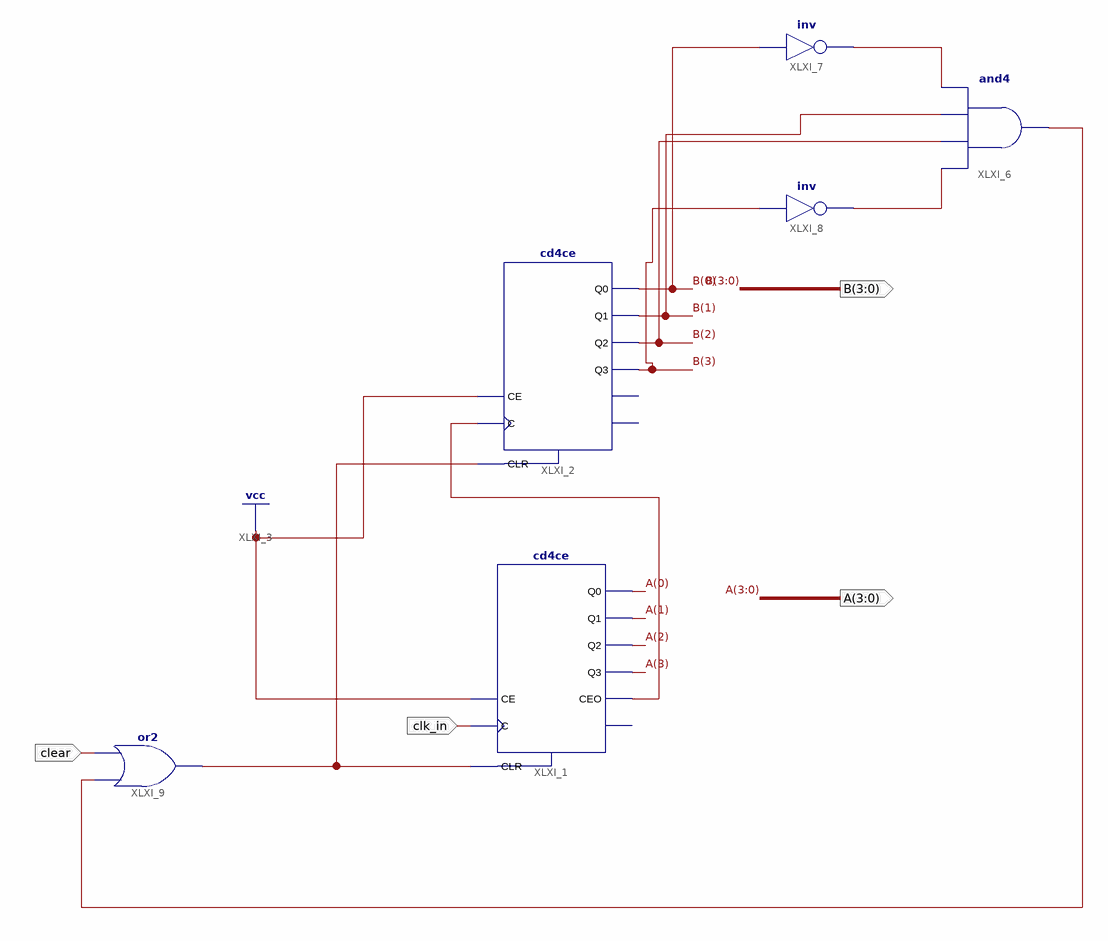
[diagram p0: schematic sheet 1]
// Xilinx ISE schematic counter_sec.sch (spartan6) as structural Verilog: 6 symbols, 4 ports
module counter_sec (
  input  clk_in,
  input  clear,
  output [3:0] A,
  output [3:0] B
);

  wire XLXN_14, XLXN_22, XLXN_26, XLXN_29, XLXN_31;

  cd4ce XLXI_1 (
    .C(clk_in), .CE(1'b1), .CLR(XLXN_31), .CEO(XLXN_14), .Q0(A[0]), .Q1(A[1]), .Q2(A[2]), .Q3(A[3]));  // open: TC
  cd4ce XLXI_2 (.C(XLXN_14), .CE(1'b1), .CLR(XLXN_31), .Q0(B[0]), .Q1(B[1]), .Q2(B[2]), .Q3(B[3]));  // open: CEO, TC
  and XLXI_6 (XLXN_29, XLXN_26, B[2], B[1], XLXN_22);
  not XLXI_7 (XLXN_22, B[0]);
  not XLXI_8 (XLXN_26, B[3]);
  or XLXI_9 (XLXN_31, XLXN_29, clear);
endmodule
